# Altium project USB_C_Converter.PrjPcb
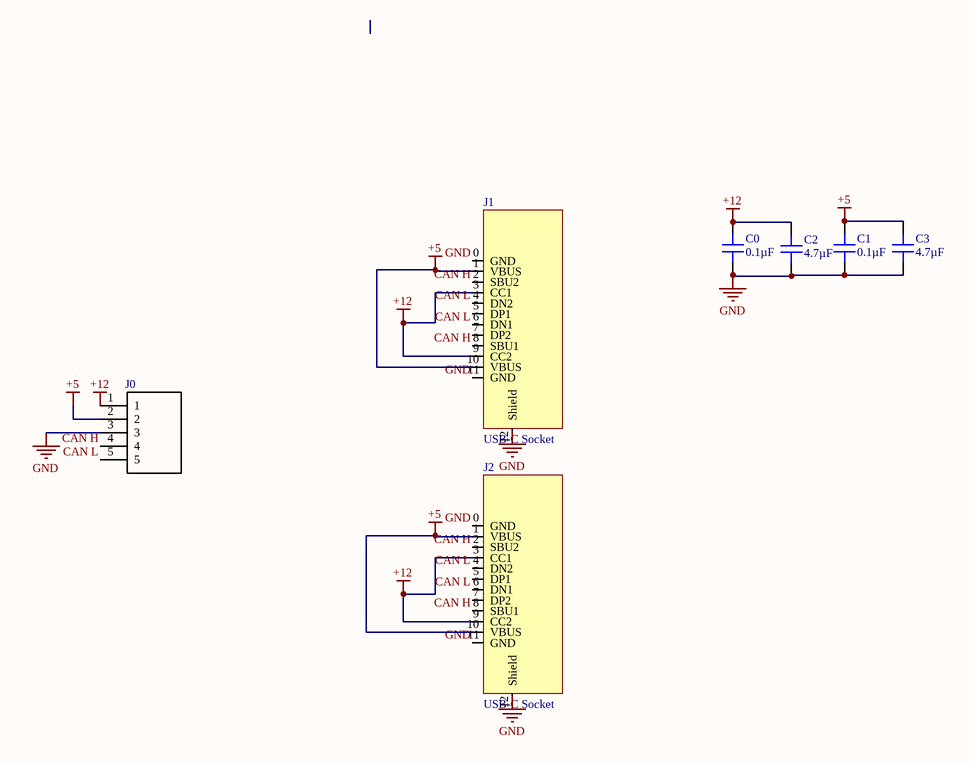
[diagram p0: USB_C_Converter.SchDoc]
1 sheet, 7 parts. Net scope: global (net labels, ports and power ports of the same name join across sheets).
Board file: USB_C_Converter.PcbDoc

## Sheet USB_C_Converter.SchDoc
size A

### Parts
C0  0.1µF  [CAP 0805_2012]
C1  0.1µF  [CAP 0805_2012]
C2  4.7µF  [CAP 0805_2012]
C3  4.7µF  [CAP 0805_2012]
J0  282834-5  [*TE_282834-5]  (value not drawn)
J1  USB-C Socket  [TYPE-C-31-M-12]
J2  USB-C Socket  [TYPE-C-31-M-12]

### Nets
+5: C1.2 C3.2 J0.2 J1.1(VBUS) J1.10(VBUS) J2.1(VBUS) J2.10(VBUS)
+12: C0.2 C2.2 J0.1 J1.3(CC1) J1.9(CC2) J2.3(CC1) J2.9(CC2)
GND: C0.1 C1.1 C2.1 C3.1 J0.3 J1.0(GND) J1.11(GND) J1.12(Shield) J2.0(GND) J2.11(GND) J2.12(Shield)
CAN H: J0.4 J1.2(SBU2) J1.8(SBU1) J2.2(SBU2) J2.8(SBU1)
CAN L: J0.5 J1.4(DN2) J1.6(DN1) J2.4(DN2) J2.6(DN1)

Not connected (* = marked no-connect by the designer): J1 5(DP1) 7(DP2); J2 5(DP1) 7(DP2)

### Library data of the parts
C0 C1 = LLA219R71C104MA01L: CAP CER 0.1UF 16V X7R 0805; Manufacturer: Murata Electronics; Tolerance: ±20%; Part Number: LLA219R71C104MA01L; Value: 0.1µF; Applications: Bypass, Decoupling; Capacitance: 0.1µF; ComponentLink1Description: Datasheet; ComponentLink1URL: https://www.murata.com/~/media/webrenewal/support/library/catalog/products/capacitor/mlcc/c02e.ashx?la=en-us; ComponentLink2Description: DigiKey Link; ComponentLink2URL: http://digikey.com/product-detail/en/murata-electronics/LLA219R71C104MA01L/490-4414-1-ND/1022558; Device Package: 0805 (2012 Metric); Features: Low ESL (Multi-Terminal); LastUpdated: 1/19/2020 4:08:48 PM; Lifecycle Status: Active; Minimum Order: 1; Mounting Type: Surface Mount, MLCC; Operating Temperature: -55°C ~ 125°C; Package / Case: 0805 (2012 Metric); Packaging: TapeAndReel; PartId: 15142; Part Status: Active; Price: 0.08; Series: LLA; Size / Dimension: 0.079" L x 0.049" W (2.00mm x 1.25mm); Supplier 1: DigiKey; Supplier Part Number 1: 490-4414-1-ND; Temperature Coefficient: X7R; Thickness (Max): 0.037" (0.95mm); Voltage - Rated: 16V
C2 C3 = GRM21BR71C475KE51L: CAP CER 4.7UF 16V X7R 0805; Manufacturer: Murata Electronics; Tolerance: ±10%; Part Number: GRM21BR71C475KE51L; Value: 4.7µF; Applications: General Purpose; Capacitance: 4.7µF; ComponentLink1Description: Datasheet; ComponentLink1URL: https://search.murata.co.jp/Ceramy/image/img/A01X/G101/ENG/GRM21BR71C475KE51-01.pdf; ComponentLink2Description: DigiKey Link; ComponentLink2URL: http://digikey.com/product-detail/en/murata-electronics/GRM21BR71C475KE51L/490-14466-1-ND/6606927; Device Package: 0805 (2012 Metric); LastUpdated: 1/19/2020 4:08:58 PM; Lifecycle Status: Active; Minimum Order: 1; Mounting Type: Surface Mount, MLCC; Operating Temperature: -55°C ~ 125°C; Package / Case: 0805 (2012 Metric); Packaging: TapeAndReel; PartId: 8696; Part Status: Active; Price: 0.04; Series: GRM; Size / Dimension: 0.079" L x 0.049" W (2.00mm x 1.25mm); Supplier 1: DigiKey; Supplier Part Number 1: 490-14466-1-ND; Temperature Coefficient: X7R; Thickness (Max): 0.055" (1.40mm); Voltage - Rated: 16V
J0 = 282834-5: Buchanan; Conn; Term Blk; PCB; 5; 2.54mm; Front; 30-16 AWG; Green; 10 A; 150 V; MF: TE Connectivity; EU_RoHS_Compliance: Compliant with Exemptions; SnapEDA_Link: https://www.snapeda.com/parts/282834-5/TE%20Connectivity%20AMP%20Connectors/view-part/641357/?ref=snap; Package: None; MP: 282834-5; Price: None; TE_purchase_URL: https://www.te.com/usa-en/product-282834-5.html?te_bu=Cor&te_type=disp&te_campaign=seda_glo_cor-seda-global-disp-prtnr-fy19-seda-model-bom-cta_sma-317_1&elqCampaignId=32493; Availability: Unavailable; Value: *
J1 J2 = TYPE-C-31-M-12